# EAGLE design untitled (EAGLE 6.1)
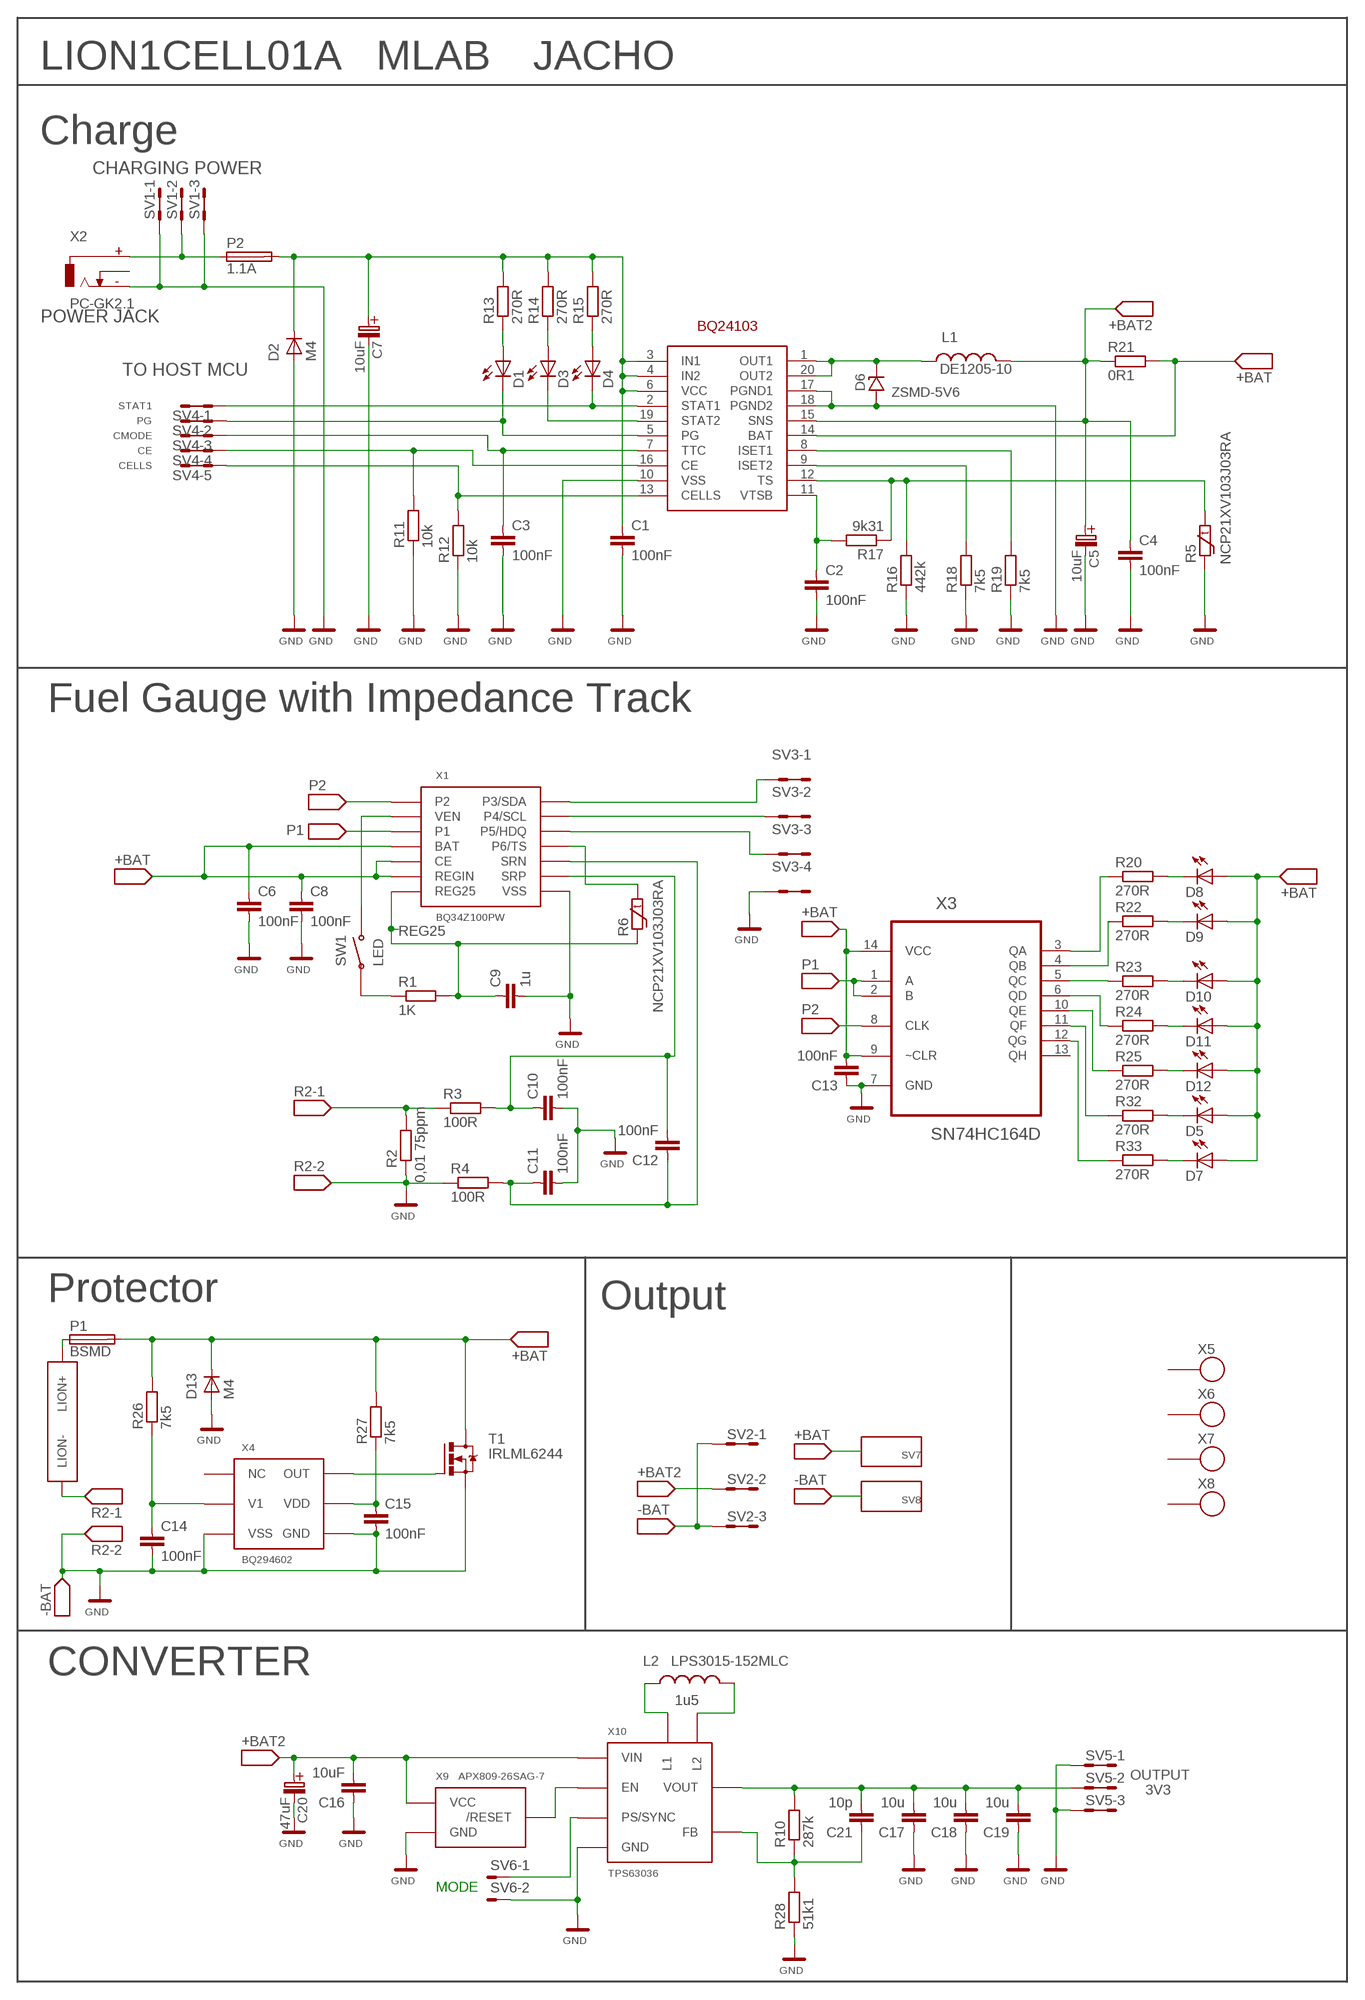
[diagram p0: schematic, sheet 1]

## Parts
C1  100nF  C0805  [C0805]
C2  100nF  C0805  [C0805]
C3  100nF  C0805  [C0805]
C4  100nF  C0805  [C0805]
C5  10uF  B  [B]
C6  100nF  C0805  [C0805]
C7  10uF  B  [B]
C8  100nF  C0805  [C0805]
C9  1u  C0805  [C0805]
C10  100nF  C0805  [C0805]
C11  100nF  C0805  [C0805]
C12  100nF  C0805  [C0805]
C13  100nF  C0805  [C0805]
C14  100nF  C0805  [C0805]
C15  100nF  C0805  [C0805]
C16  10uF  C0805  [C0805]
C17  10u  C0805  [C0805]
C18  10u  C0805  [C0805]
C19  10u  C0805  [C0805]
C20  47uF  B  [B]
C21  10p  C0603  [0603]
D1  LED1206_2  [1206_2]
D2  M4  D-OB.  [SMB]
D3  LED1206_2  [1206_2]
D4  LED1206_2  [1206_2]
D5  LED1206_2  [1206_2]
D6  ZSMD-5V6  D-ZENEROVA  [MINIMELF]
D7  LED1206_2  [1206_2]
D8  LED1206_2  [1206_2]
D9  LED1206_2  [1206_2]
D10  LED1206_2  [1206_2]
D11  LED1206_2  [1206_2]
D12  LED1206_2  [1206_2]
D13  M4  D-OB.SMA  [SMA]
L1  DE1205-10  [DE1205-10]
L2  LPS3015-152MLC  LPS3015  [LPS3015]
P1  BSMD  POJISTKA2410  [2410]
P2  1.1A  POJISTKA_1812  [1812]
R1  1K  R0805  [0805]
R2  0,01 75ppm  R0805  [0805]
R3  100R  R0805  [0805]
R4  100R  R0805  [0805]
R5  NCP21XV103J03RA  TERMISTOR0805  [0805]
R6  NCP21XV103J03RA  TERMISTOR0805  [0805]
R10  287k  R0603  [0603]
R11  10k  R0805  [0805]
R12  10k  R0805  [0805]
R13  270R  R0805  [0805]
R14  270R  R0805  [0805]
R15  270R  R0805  [0805]
R16  442k  R0805  [0805]
R17  9k31  R0805  [0805]
R18  7k5  R0805  [0805]
R19  7k5  R0805  [0805]
R20  270R  R0805  [0805]
R21  0R1  R-EU_R2512  [R2512]
R22  270R  R0805  [0805]
R23  270R  R0805  [0805]
R24  270R  R0805  [0805]
R25  270R  R0805  [0805]
R26  7k5  R0805  [0805]
R27  7k5  R0805  [0805]
R28  51k1  R0603  [0603]
R32  270R  R0805  [0805]
R33  270R  R0805  [0805]
SV1  MA03-2  [MA03-2]
SV2  MA03-2  [MA03-2]
SV3  MA04-2  [MA04-2]
SV4  MA05-2  [MA05-2]
SV5  MA03-2  [MA03-2]
SV6  MA02-1  [MA02-1]
SV7  WAGO256  [WAGO256]
SV8  WAGO256  [WAGO256]
SW1  TACT-64K  [TACT-64K]
T1  IRLML6244  IRLML6244TRPBF  [SOT23]
U1  BQ24103  [RHL_R-VQFN-N20]
U$2  LION1  [LION1]
X1  BQ34Z100PW  [TSSOP14]
X2  DC2.1MM  [DC2.1MM]
X3  SN74HC164D  [SOIC127P600X175-14N]
X4  BQ294602  [SON_N6]
X5  SROUB3M  [SROUB3M]
X6  SROUB3M  [SROUB3M]
X7  SROUB3M  [SROUB3M]
X8  SROUB3M  [SROUB3M]
X9  APX809-26SAG-7  APX809-26SA  [SOT23]
X10  TPS63036  [DSBGA8]

## Nets
+BAT: C6.1 C8.1 C13.2 D5.A D7.A D8.A D9.A D10.A D11.A D12.A D13.K(C) P1.2 R21.2 R26.2 R27.2 SV7.1 SV7.A1 T1.3(D) U1.14(BAT) X1.4(BAT) X1.5(CE) X1.6(REGIN) X3.9(~CLR) X3.14(VCC)
+BAT2: C4.1 C5.+(C_EL+) C16.2 C20.+(C_EL+) L1.P$2 R21.1 SV2.3 SV2.4 U1.15(SNS) X9.3(VCC) X10.A1(VIN)
EN: X9.2(/RESET) X10.A2(EN)
GND: C1.2 C2.2 C3.2 C4.2 C5.-(C_EL-) C6.2 C7.-(C_EL-) C8.2 C9.2 C10.2 C11.2 C13.1 C14.2 C15.2 C16.1 C17.1 C18.1 C19.1 C20.-(C_EL-) D2.A D6.A D13.A R2.1 R4.1 R5.1 R11.1 R12.1 R16.1 R18.1 R19.1 R28.1 SV1.1 SV1.2 SV1.5 SV1.6 SV2.1 SV2.2 SV2.5 SV2.6 SV3.7 SV3.8 SV5.1 SV5.2 SV5.5 SV5.6 SV6.2 SV8.1 SV8.A1 T1.2(S) U1.10(VSS) U1.17(PGND1) U1.18(PGND2) X1.8(VSS) X2.GND(-) X3.7(GND) X4.3(VSS) X4.4(VSS) X4.7(GND) X9.1(GND) X10.C2(GND)
N$1: C1.1 C7.+(C_EL+) D2.K(C) P2.2 R13.2 R14.2 R15.2 U1.3(IN1) U1.4(IN2) U1.6(VCC)
N$2: P1.1 U$2.+1(LION+) U$2.+(LION+)
N$3: D6.C(K) L1.P$1 U1.1(OUT1) U1.20(OUT2)
N$4: D4.K(C) SV4.1 SV4.2 U1.2(STAT1)
N$5: D3.K(C) U1.19(STAT2)
N$6: D1.K(C) SV4.3 SV4.4 U1.5(PG)
N$7: D1.A R13.1
N$8: D3.A R14.1
N$9: D4.A R15.1
N$10: R12.2 SV4.9 SV4.10 U1.13(CELLS)
N$11: R11.2 SV4.7 SV4.8 U1.16(CE)
N$12: C2.1 R17.2 U1.11(VTSB)
N$13: R18.2 U1.9(ISET2)
N$14: C3.1 SV4.5 SV4.6 U1.7(TTC)
N$15: R19.2 U1.8(ISET1)
N$16: SV3.3 SV3.4 X1.13(P4/SCL)
N$17: SW1.P$3 SW1.P$4 X1.2(VEN)
N$18: R5.2 R16.2 R17.1 U1.12(TS)
N$19: L2.1-1 L2.1-2 L2.1-3 X10.B1(L1)
N$20: R1.1 SW1.P$1 SW1.P$2
N$21: SV6.1 X10.B2(PS/SYNC)
N$22: R6.2 X1.11(P6/TS)
N$23: C10.1 C12.2 R3.2 X1.9(SRP)
N$24: SV3.5 SV3.6 X1.12(P5/HDQ)
N$25: SV3.1 SV3.2 X1.14(P3/SDA)
N$26: L2.2-1 L2.2-2 L2.2-3 X10.C1(L2)
N$27: C11.1 C12.1 R4.2 X1.10(SRN)
N$31: C17.2 C18.2 C19.2 C21.2 R10.2 SV5.3 SV5.4 X10.D1(VOUT)
N$32: C21.1 R10.1 R28.2 X10.D2(FB)
N$33: R20.1 X3.3(QA)
N$34: D8.K(C) R20.2
N$35: R22.1 X3.4(QB)
N$36: R23.1 X3.5(QC)
N$37: R24.1 X3.6(QD)
N$38: R25.1 X3.10(QE)
N$39: D9.K(C) R22.2
N$40: D11.K(C) R24.2
N$41: D12.K(C) R25.2
N$42: D10.K(C) R23.2
N$43: C14.1 R26.1 X4.2(V1)
N$44: C15.1 R27.1 X4.5(VDD)
N$45: T1.1(G) X4.6(OUT)
N$46: R32.1 X3.11(QF)
N$47: R33.1 X3.12(QG)
N$49: D5.K(C) R32.2
N$50: D7.K(C) R33.2
N$69: P2.1 SV1.3 SV1.4 X2.+
P1: X1.3(P1) X3.1(A) X3.2(B)
P2: X1.1(P2) X3.8(CLK)
R2: R2.2 R3.1 U$2.-1(LION-) U$2.-(LION-)
REG25: C9.1 R1.2 R6.1 X1.7(REG25)
Unconnected: X2.SW X3.13(QH) X4.1(NC) X5.P$1 X6.P$1 X7.P$1 X8.P$1

## Notes on the sheet
- LION1CELL01A | MLAB | JACHO
- Charge
- CHARGING POWER
- POWER JACK
- TO HOST MCU
- STAT1
- PG
- CMODE
- CE
- CELLS
- Fuel Gauge with Impedance Track
- REG25
- LED
- Protector | Output
- CONVERTER
- 1u5
- OUTPUT
- 3V3
- MODE

## Library data of the parts
C1-C4 C6 C8-C19 = moje_C:C0805
C5 C7 C20 = moje_C:B
C21 = moje_C:C0603
D1 D3-D5 D7-D12 = moje_diody:LED1206_2
D2 = moje:D-OB.: smb
D6 = moje_diody:D-ZENEROVA
D13 = moje:D-OB.SMA: SMA
L1 = moje_L:DE1205-10: tlumivka
L2 = moje_L:LPS3015
P1 = moje:POJISTKA2410: Pojistka BSMD (tme) v pouzdru 2410
P2 = moje:POJISTKA_1812: Pojistka s pouzdrem 1812
R1-R4 R11-R20 R22-R27 R32 R33 = moje_R:R0805
R5 R6 = moje_R:TERMISTOR0805
R10 R28 = moje_R:R0603
R21 = rcl:R-EU_: RESISTOR, European symbol
SV1 SV2 SV5 = moje_hrebinky:MA03-2: PIN HEADER; OC_FARNELL: unknown; OC_NEWARK: unknown
SV3 = moje_hrebinky:MA04-2: PIN HEADER; OC_FARNELL: unknown; OC_NEWARK: unknown
SV4 = moje_hrebinky:MA05-2: PIN HEADER; OC_FARNELL: unknown; OC_NEWARK: unknown
SV6 = moje_hrebinky:MA02-1
SV7 SV8 = moje_konektory:WAGO256: WAGO256
SW1 = moje_tlacitka:TACT-64K: Resetovací tlačítko TACT-64K
T1 = moje_T:IRLML6244TRPBF: HEXFET Power MOSFET
U1 = bq24103:BQ24103
U$2 = moje_baterky:LION1
X1 = moje_io:BQ34Z100PW
X2 = moje_konektory:DC2.1MM
X3 = moje_io:SN74HC164D: 8-BIT PARALLEL-OUT SERIAL SHIFT REGISTERS; MPN: SN74HC164D; OC_FARNELL: 9591184; OC_NEWARK: 36K3553; PACKAGE: SOIC-14; SUPPLIER: Texas Instruments
X4 = moje_io:BQ294602
X5-X8 = moje:SROUB3M
X9 = moje_io:APX809-26SA
X10 = moje_io:TPS63036

## Board
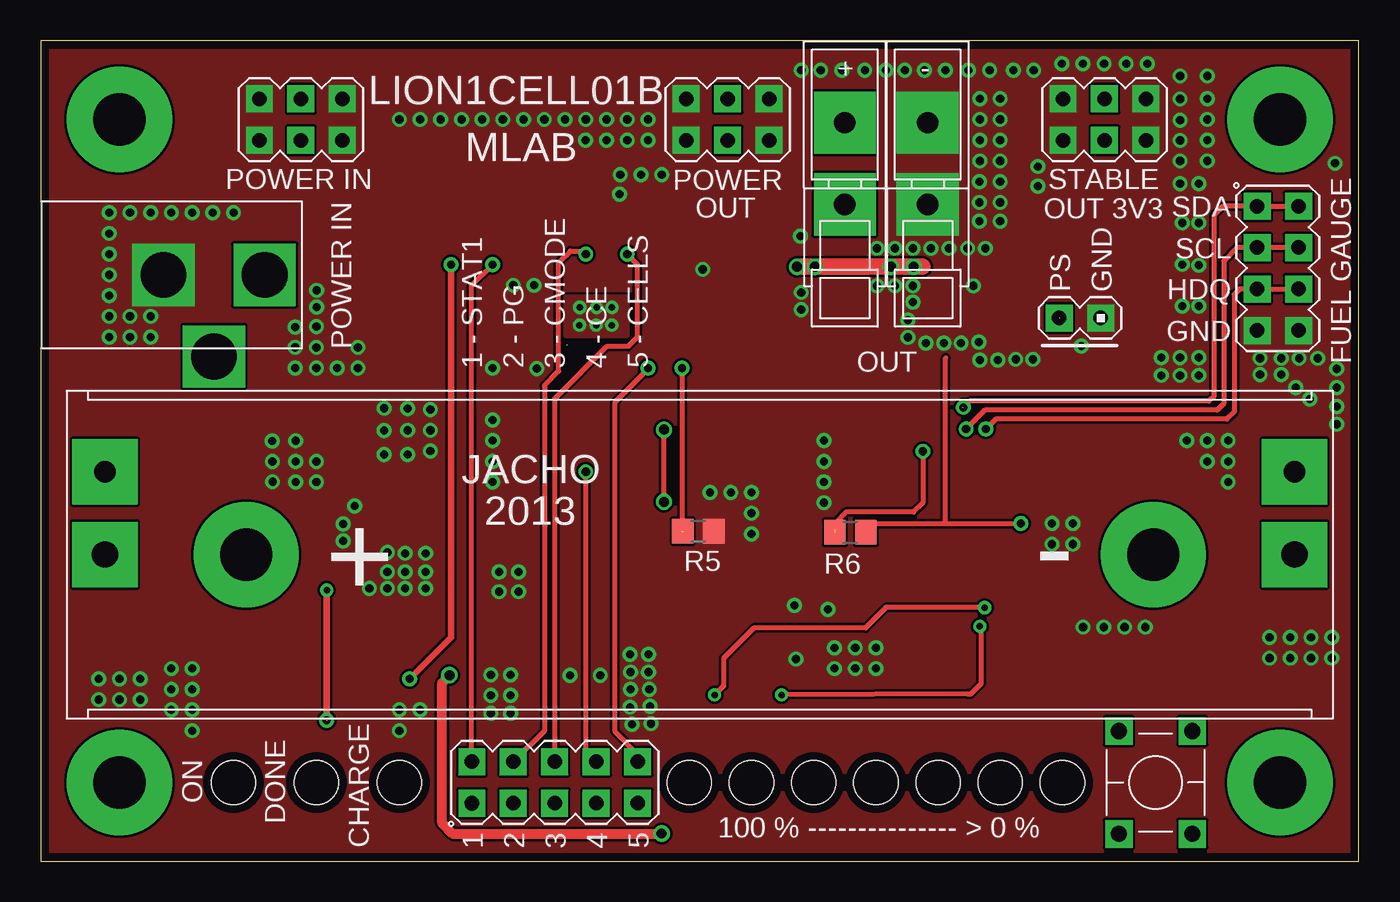
[diagram p1: board, top side]
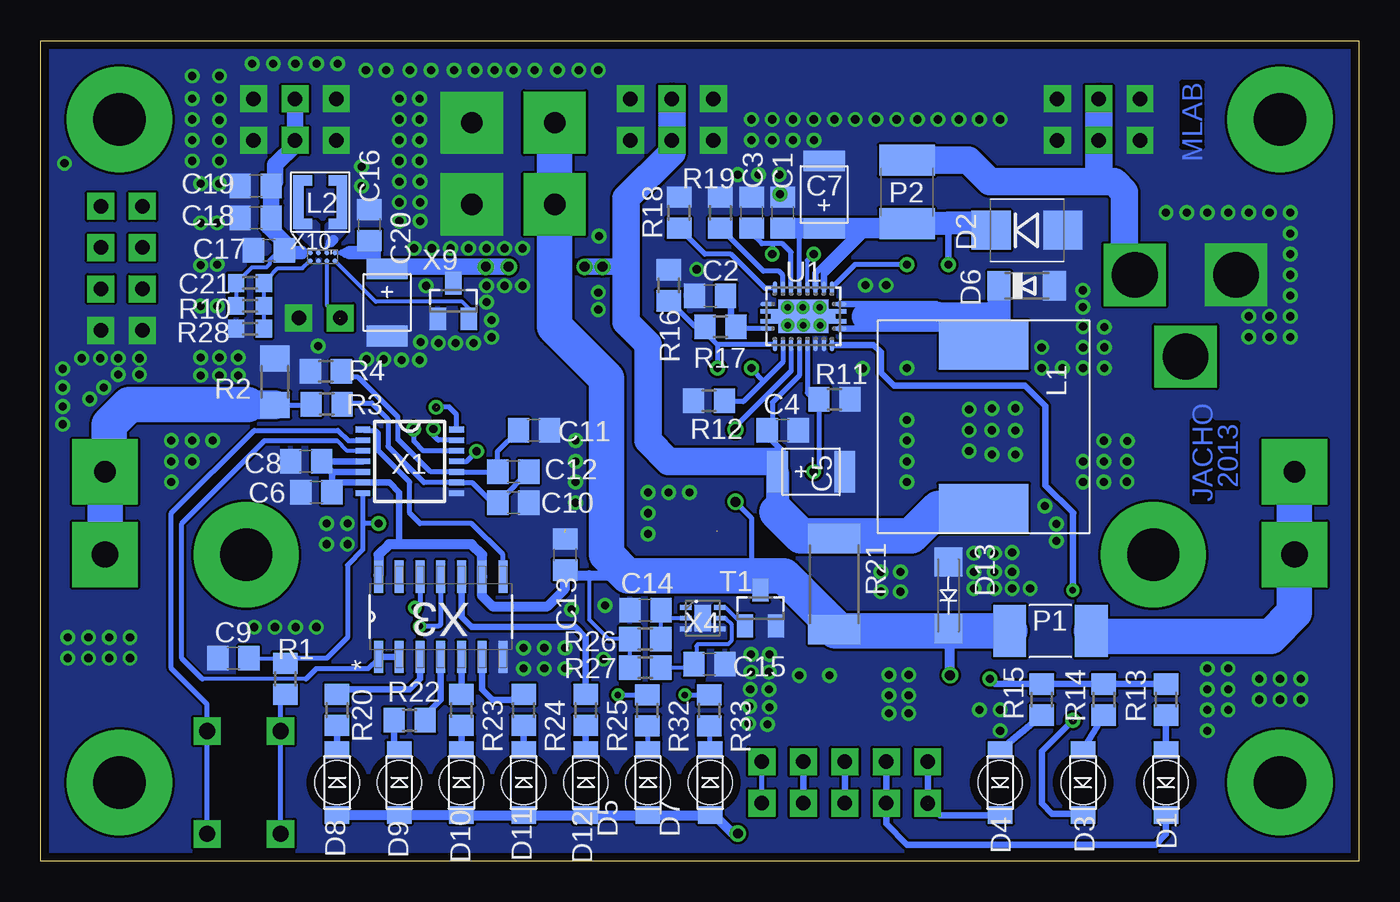
[diagram p2: board, bottom side, seen from below]

Size 80.77 x 50.29 mm. Coordinates in mm from the lower left corner, seen from the top.
Outline: 0,0 80.77,0 80.77,50.29 0,50.29 0,0
Copper layers (1*16): Top 0.035mm / dielectric 1.5mm / Bottom 0.035mm
Design rules: minimum track width 8mil, minimum drill 16mil, track to track 6mil, track to pad 6mil, pad to pad 6mil, via to via 6mil, smd to smd 6mil, copper to edge 20mil, drill to drill 8mil, minimum pad ring 10mil, minimum via ring 8mil, stop-mask expansion 4mil, vias tented up to drill 25mil, thermal gap 0mil

### Footprints (pad centres in the part's own frame; a part is rotated, then mirrored left to right if it is on the bottom)
C0805 = smd 1.3 x 1.5: 1 -0.95,0; 2 0.95,0
B = smd 1.27 x 2.54: + 2.223,0; - -1.905,0
0603 = smd 1 x 1.1: 1 -0.85,0; 2 0.85,0
1206_2 = smd 1.5 x 1.05: A 0,-2; K 0,2 | hole 2.7: 0,0
SMB = smd 2.4 x 2.4: A 2.2,0; K -2.2,0
MINIMELF = smd 1.4 x 1.8: A 1.7,0; C -1.7,0
SMA = smd 1.8 x 1.7: A -2.05,0; K 2.05,0
DE1205-10 = smd 3 x 5.5: P$1 -5,0; P$2 5,0
LPS3015 = smd 0.64 x 3.3: 1-1 -1.33,0; 2-1 1.33,0 | smd 0.51 x 0.64: 1-2 -0.765,1.33; 1-3 -0.765,-1.33; 2-2 0.765,-1.33; 2-3 0.765,1.33
2410 = smd 2 x 3.18: 1 -2.5,0; 2 2.5,0
1812 = smd 1.9 x 3.4: 1 -1.95,0; 2 1.95,0
0805 = smd 1.3 x 1.5: 1 -0.95,0; 2 0.95,0
1206 = smd 1.6 x 1.803: 1 -1.422,0; 2 1.422,0
R2512 = smd 1.8 x 3.2: 1 -2.8,0; 2 2.8,0
MA03-2 = drill 0.889 pad 1.651 square: 1 -2.54,-1.27; 2 -2.54,1.27; 3 0,-1.27; 4 0,1.27; 5 2.54,-1.27; 6 2.54,1.27
MA04-2 = drill 0.889 pad 1.651 square: 1 -3.81,-1.27; 2 -3.81,1.27; 3 -1.27,-1.27; 4 -1.27,1.27; 5 1.27,-1.27; 6 1.27,1.27; 7 3.81,-1.27; 8 3.81,1.27
MA05-2 = drill 0.914 pad 1.651 square: 1 -5.08,-1.27 | drill 0.889 pad 1.651 square: 2 -5.08,1.27; 3 -2.54,-1.27; 4 -2.54,1.27; 5 0,-1.27; 6 0,1.27; 7 2.54,-1.27; 8 2.54,1.27; 9 5.08,-1.27; 10 5.08,1.27
MA02-1 = drill 0.889 pad 1.651 square: 1 -1.27,0; 2 1.27,0
WAGO256 = drill 1.3 pad 3.81 square: 1 2.54,0; A1 -2.46,0
TACT-64K = drill 1 pad 1.676 square: P$1 -3.15,2.25; P$2 3.15,2.25; P$3 -3.15,-2.25; P$4 3.15,-2.25
SOT23 = smd 1 x 1.4: 1 -0.95,-1.1; 2 0.95,-1.1; 3 0,1.1
RHL_R-VQFN-N20 = smd 0.85 x 0.28: 1 -2.225,-0.75; 10 2.225,-0.75; 11 2.225,0.75; 20 -2.225,0.75 | smd 0.28 x 0.85: 2 -1.75,-1.725; 3 -1.25,-1.725; 4 -0.75,-1.725; 5 -0.25,-1.725; 6 0.25,-1.725; 7 0.75,-1.725; 8 1.25,-1.725; 9 1.75,-1.725; 12 1.75,1.725; 13 1.25,1.725; 14 0.75,1.725; 15 0.25,1.725; 16 -0.25,1.725; 17 -0.75,1.725; 18 -1.25,1.725; 19 -1.75,1.725 | smd 3.05 x 2.05: EXP@1 0,0 | smd 1.125 x 0.28: EXP@2 2.075,-0.3; EXP@4 2.075,0.3; EXP@5 -2.075,0.3; EXP@7 -2.075,-0.3 | smd 0.45 x 0.4: EXP@3 1.75,0; EXP@6 -1.75,0
LION1 = drill 1.6 pad 4 square: + -36.45,0; - 36.45,0 | drill 1.3 pad 4 square: +1 -36.45,5.08; -1 36.45,5.08 | drill 3.2 pad 6.452: SROUB3 -27.805,0; SROUB4 27.805,0
TSSOP14 = smd 0.9 x 0.35: 1 -2.875,1.95; 2 -2.875,1.3; 3 -2.875,0.65; 4 -2.875,0; 5 -2.875,-0.65; 6 -2.875,-1.3; 7 -2.875,-1.95; 8 2.875,-1.95; 9 2.875,-1.3; 10 2.875,-0.65; 11 2.875,0; 12 2.875,0.65; 13 2.875,1.3; 14 2.875,1.95
DC2.1MM = drill 2.8 square: + -3.81,0; GND 2.39,0; SW -0.71,5
SOIC127P600X175-14N = smd 1.981 x 0.559: 1 -2.464,3.81; 2 -2.464,2.54; 3 -2.464,1.27; 4 -2.464,0; 5 -2.464,-1.27; 6 -2.464,-2.54; 7 -2.464,-3.81; 8 2.464,-3.81; 9 2.464,-2.54; 10 2.464,-1.27; 11 2.464,0; 12 2.464,1.27; 13 2.464,2.54; 14 2.464,3.81
SON_N6 = smd 0.3 x 0.7: 1 -0.65,-1.05; 2 0,-1.05; 3 0.65,-1.05; 4 0.65,1.05; 5 0,1.05; 6 -0.65,1.05 | smd 1.6 x 1: 7 0,0
SROUB3M = drill 3.2 pad 6.452: P$1 0,0
DSBGA8 = smd 0.3 x 0.3: A1 -0.75,-0.25; A2 -0.75,0.25; B1 -0.25,-0.25; B2 -0.25,0.25; C1 0.25,-0.25; C2 0.25,0.25; D1 0.75,-0.25; D2 0.75,0.25

### Placement (x,y rotation side)
C1  35.31,39.75 90 bottom
C2  39.75,34.67 180 bottom
C3  37.21,39.75 90 bottom
C4  35.31,26.42 0 bottom
C5  33.4,23.88 180 bottom
C6  63.88,22.61 180 bottom
C7  32.77,41.02 270 bottom
C8  64.52,24.51 180 bottom
C9  68.96,12.45 180 bottom
C10  51.82,21.97 0 bottom
C11  50.55,26.42 0 bottom
C12  51.82,23.88 0 bottom
C13  48.64,18.8 270 bottom
C14  43.72,15.4 180 bottom
C15  39.8,12.08 0 bottom
C16  60.65,39 270 bottom
C17  66.8,37.45 0 bottom
C18  67.6,39.45 0 bottom
C19  67.6,41.4 0 bottom
C20  59.55,34.1 90 bottom
C21  67.95,35.45 180 bottom
D1  11.81,4.83 180 bottom
D2  20.33,38.68 0 bottom
D3  16.89,4.83 180 bottom
D4  21.97,4.83 180 bottom
D5  43.56,4.83 0 bottom
D6  20.35,35.27 0 bottom
D7  39.75,4.83 0 bottom
D8  62.61,4.83 0 bottom
D9  58.8,4.83 0 bottom
D10  54.99,4.83 0 bottom
D11  51.18,4.83 0 bottom
D12  47.37,4.83 0 bottom
D13  25.15,16.3 270 bottom
L1  22.98,26.63 270 bottom
L2  63.65,40.4 180 bottom
P1  18.89,14.11 180 bottom
P2  27.69,41.02 270 bottom
R1  65.79,11.18 90 bottom
R2  0,01 75ppm  [1206]  66.42,29.39 270 bottom
R3  63.25,28.02 0 bottom
R4  63.3,30.03 0 bottom
R5  40.3,20.23 180 top
R6  49.62,20.16 180 top
R10  67.95,34.05 180 bottom
R11  32.13,28.32 180 bottom
R12  39.82,28.23 0 bottom
R13  11.81,9.91 90 bottom
R14  15.62,9.91 90 bottom
R15  19.43,9.91 90 bottom
R16  42.29,35.31 270 bottom
R17  39.12,32.77 0 bottom
R18  41.66,39.75 270 bottom
R19  39.12,39.75 270 bottom
R20  62.61,9.27 270 bottom
R21  32.15,17 270 bottom
R22  58.17,8.64 180 bottom
R23  54.99,9.27 270 bottom
R24  51.18,9.27 270 bottom
R25  47.37,9.27 270 bottom
R26  43.72,13.63 180 bottom
R27  43.72,11.87 180 bottom
R28  67.95,32.65 0 bottom
R32  43.6,9.25 270 bottom
R33  39.8,9.25 270 bottom
SV1  15.94,45.47 0 top
SV2  42.1,45.47 0 top
SV3  75.82,36.34 270 top
SV4  31.5,4.83 0 top
SV5  65.2,45.47 180 top
SV6  63.7,33.3 0 top
SV7  49.28,42.81 270 top
SV8  54.36,42.81 270 top
SW1  68.33,4.83 90 top
T1  36.67,15.52 0 bottom
U1  34.04,33.4 180 bottom
U$2  40.39,18.8 0 top
X1  58.17,24.51 0 bottom
X2  9.91,35.94 180 top
X3  56.26,14.99 90 bottom
X4  40.21,14.9 270 bottom
X5  4.83,4.83 0 top
X6  4.83,45.47 180 top
X7  75.95,45.47 90 top
X8  75.95,4.83 0 top
X9  55.5,34.35 0 bottom
X10  63.5,37.05 180 bottom

### Tracks (layer width: path | path; a pad name or v marks a point on that pad's centre or on a via)
+BAT  (via drill 0.6)
  Top 0.305: v38.2,22.03 v38.2,26.46
  Top 0.61: v25.05,11.4 24.6,10.95 24.6,2.35 25.25,1.7 v38.05,1.7
  Bottom 0.254: U1.14 34.79,31.38 | R27.2 R26.2 45.98,13.63 47.15,14.8 47.15,17.53 | D13.K 24.5,14.3 24.75,14.05 24.8,14.05 25.05,13.8 25.15,13.8
  Bottom 0.305: 34.79,31.38 34.79,30.06 38.15,26.7 38.2,26.7 v38.2,26.46 | v38.2,22.03 37.21,21.04 37.21,17.38 | 37.21,17.38 37.25,17.35 | 37.21,17.38 37.29,17.38 37.4,17.49
  Bottom 0.406: 62.93,23.88 C8.1 X1.4 | 62.93,23.88 C6.1 62.9,23.21 X1.6 59.41,23.21 58.8,22.61 58.8,19.43 | X1.5 62.92,23.86 62.93,23.88 | 60.07,17.53 X3.14 | 48.2,31.8 48.31,31.8 49.03,32.52
  Bottom 0.61: 60.07,17.53 60.07,18.8 59.44,19.43 58.8,19.43 54.36,19.43 53.72,18.8 X3.9 53.72,16.26 53.09,15.62 49.72,15.62 48.65,16.7 48.65,17.7 48.7,17.75 48.7,17.79 C13.2 48.64,17.53 47.15,17.53 45.47,17.53 | 39.8,2.92 39.8,2.8 40.25,2.8 40.25,2.83 | D5.A D12.A D11.A D10.A D9.A | D5.A 43.5,2.83 43.5,2.8 43.56,2.8 D5.A | D5.A 40.25,2.83 | 40.25,2.83 D7.A | D9.A 58.85,2.83 58.85,2.8 | D9.A D8.A | D5.A 39.48,2.83 38.35,1.7 v38.05,1.7 | v25.05,11.4 25.05,13.8 25.05,13.86 25.3,14.11
  Bottom 0.813: 44.2,17.53 44.83,17.53 45.47,17.53 | T1.3 39.12,17.49
  Bottom 1.016: 49.28,33.25 49.28,36.22 48.95,36.55
  Bottom 1.422: 36.89,17.8 36.58,17.49
  Bottom 2.184: SV7.A1 SV7.1 49.28,33.25 49.28,32.77 49.03,32.52 46.1,29.59 46.1,18.8 44.83,17.53 44.79,17.49 39.12,17.49 37.4,17.49 36.58,17.49 35.24,17.49 32.05,14.3 R21.2 32.06,14.11 25.3,14.11 P1.2
+BAT2  (via drill 0.6)
  Top 1.016: 46.4,36.45 v47.45,36.45 51.9,36.45 v52.1,36.45 54.05,36.45
  Bottom 0.254: C5.+ 35.31,23.88 | X10.A1 62.35,37.3 | 61.8,37.1 62,37.3
  Bottom 0.305: U1.15 34.29,29.78 35.94,28.12 35.94,26.42 C4.1 | 34.2,19.95 32.4,19.95 32.3,19.85 32.3,19.8 32.2,19.7 | 32.2,19.7 32.2,19.8 32.15,19.85 | R21.1 32.15,19.75 32.2,19.7
  Bottom 0.406: 35.31,23.88 35.31,25.15 36.26,26.1 | 36.26,26.1 36.58,26.42 | C4.1 36.26,26.1 | C5.+ 35.62,24.19 35.94,24.51 | 62.35,37.3 62.1,37.3
  Bottom 0.61: 62.1,37.3 62,37.3 61.85,37.3
  Bottom 0.813: 61.85,37.3 60.4,37.3 60.35,37.25 | 60.35,37.25 60.35,37.75 C16.2 | 60.35,37.25 60.35,36.55 60.3,36.5 59.72,36.5 C20.+ | X9.3 55.5,36.45
  Bottom 1.016: C20.+ 59.05,36.32 59.05,36.45 55.5,36.45 v53.5,36.45 v52.1,36.45 54.45,36.45 | 44.9,36.45 v46.35,36.45 v47.45,36.45 | 44.85,36.55 44.85,36.45 44.9,36.45 | 44.9,36.45 44.9,36.25
  Bottom 1.422: C5.+ 35.62,21.37 | 35.25,20.9 35.62,21.27 35.62,21.37 | 35.62,21.37 35.65,21.4 | 27.47,19.57 27.85,19.95
  Bottom 1.676: 35.94,24.51 42.29,24.51 43.56,25.78 43.56,31.71 44.9,33.05 44.9,36.25 44.9,40.65 42.1,43.45 SV2.3 SV2.4
  Bottom 2.184: L1.P$2 25.76,21.63 27.45,19.95 27.85,19.95 34.2,19.95 35.65,21.4
EN
  Bottom 0.254: X9.2 54.55,33.9 54.95,34.3 60.25,34.3 X10.A2
GND  (via drill 0.5)
  other vias: 48.64,13.08 49.91,13.08 51.18,13.08 51.18,11.81 49.91,11.81 48.64,11.81 61.98,20.7 63.25,20.7 61.98,19.43 63.25,19.43 35.52,42.09 36.79,42.09 38.06,42.09 35.48,40.89 40.57,36.28 16.89,23.24 16.89,24.51 15.62,23.24 15.62,24.51 14.19,24.51 14.2,23.26 16.89,32.77 16.91,33.97 19.43,31.5 16.89,31.5 16.91,35 16.89,30.23 18.16,30.23 19.43,30.23 23.24,45.47 24.51,45.47 25.78,45.47 27.05,45.47 28.32,45.47 29.59,45.47 30.86,45.47 32.13,45.47 33.4,45.47 34.67,45.47 34.67,44.2 35.94,44.2 37.21,44.2 33.38,44.2 4.19,39.75 5.46,39.75 6.73,39.75 8,39.75 9.27,39.75 10.54,39.75 11.81,39.75 75.31,13.72 76.58,13.72 77.85,13.72 79.12,13.72 75.31,12.45 76.58,12.45 77.85,12.45 79.12,12.45 63.88,14.35 65.15,14.35 66.42,14.35 67.69,14.35 3.56,11.18 4.83,11.18 6.1,11.18 3.56,9.91 4.83,9.91 6.1,9.91 28.79,11.42 15.63,25.78 22.48,24.94 14.18,25.76 21.04,27.77 21.04,26.4 21.04,24.93 23.88,26.42 23.88,27.69 27.69,30.23 30.4,30.21 21.97,45.47 36.11,9.44 37.24,11.59 36.12,12.69 30.23,35.31 28.96,35.31 15.59,30.23 15.59,31.51 15.59,32.74 4.19,38.48 4.19,37.21 4.19,35.94 4.19,34.67 4.19,33.4 4.19,32.13 5.46,32.13 6.73,32.13 6.73,33.4 5.46,33.4 48.01,21.97 48.01,23.24 48.01,24.51 48.01,25.78 72.77,23.25 70.23,25.78 71.5,25.78 72.77,25.78 71.5,24.51 72.77,24.51 41.02,22.61 42.29,22.61 43.56,22.61 43.56,21.34 43.56,20.07 23.88,25.15 27.69,27.05 27.69,25.78 27.69,24.51 27.69,23.24 22.48,26.42 22.48,27.75 21.97,9.27 21.97,8 23.24,9.27 9.27,8 9.27,9.27 9.27,10.54 9.27,11.81 8,11.81 8,10.54 8,9.27 71.5,46.74 35.94,45.47 71.5,45.47 37.21,45.47 71.5,42.93 71.5,44.2 58.8,46.74 58.8,45.47 58.8,44.2 58.8,42.93 58.8,41.66 57.53,41.66 57.53,40.39 58.8,40.39 57.55,46.74 57.55,45.47 57.55,44.2 57.55,42.93 52.95,48.49 54.15,48.49 55.45,48.49 56.85,48.49 58.15,48.49 28.79,10.17 51.25,37.57 52.35,37.57 53.45,37.57 54.55,37.57 55.65,37.57 56.8,37.57 57.9,37.57 51.25,35.27 52.35,35.27 53.45,35.27 53.45,34.27 53.15,32.12 53.15,33.17 79.42,26.78 79.42,27.88 79.42,29.03 79.42,30.18 78.27,30.83 79.32,42.78 77.77,28.33 76.92,29.03 76.02,29.83 74.72,29.83 70.97,29.78 69.82,29.78 68.67,29.78 68.67,30.88 69.82,30.88 70.97,30.88 70.97,34.03 70.97,36.53 70.97,39.13 70.97,41.53 69.82,41.53 69.82,42.93 69.82,44.18 69.82,45.43 69.82,46.73 69.82,48.13 67.82,48.88 66.52,48.88 65.17,48.88 63.87,48.88 62.57,48.88 71.5,48.14 59.6,48.49 60.85,48.49 61.1,41.39 61.1,42.59 63.77,31.58 36.14,11.59 36.14,10.54 22.34,18.88 21.24,18.93 22.34,17.73 21.24,17.73 28.09,17.73 29.29,17.73 29.29,16.53 28.09,16.53 57.53,39.24 58.8,39.24 46.6,48.49 47.8,48.49 49.1,48.49 50.5,48.49 51.8,48.49 37.29,10.54 37.24,12.69 27.59,11.42 27.59,10.17 46.19,15.69 48.24,15.44 46.29,12.39 36.24,8.39 37.34,9.49 34.29,11.39 37.39,8.44 27.59,9.07 28.79,9.07 32.44,11.39 57.15,35.27 54.25,31.77 55.35,31.77 56.4,31.77 57.5,31.82 57.55,30.72 58.65,30.72 59.75,30.77 60.8,30.77 74.72,30.83 76.02,30.83 77.12,30.83 69.97,34.03 69.97,36.58 69.97,39.13 46.55,38.32 46.6,33.82 46.6,34.87 21.24,16.73 22.34,16.73 20.14,16.73 19.24,21.78 18.54,20.68 18.54,19.63 23.59,18.88 23.59,17.73 23.59,16.73
  pour Bottom (rank 2): -0.25,-0.25 81.03,-0.25 81.03,50.55 -0.25,50.55
  pour Top (rank 2): -0.25,-0.89 80.39,-0.89 81.03,-0.25 81.03,55.63 76.58,54.36 4.19,53.09 -0.25,53.72
N$1  (via drill 0.5)
  Top 0.406: v22.61,11.18 25.15,13.72 v25.15,36.58
  Bottom 0.254: U1.6 34.29,38.23
  Bottom 0.305: U1.6 34.29,38.55 | 34.29,38.23 33.4,39.12 | 30.86,38.48 31.5,38.48 | 27.96,38.8 28.49,38.8 28.68,38.99 28.55,38.99 28.4,39.13 | 28.4,39.13 28.3,39.24 28.34,39.28 28.34,39.24 28.38,39.2 28.38,39.15 28.3,39.07 28.34,39.07 | 28.32,39.12 28.39,39.12 28.4,39.13
  Bottom 0.406: 34.29,38.55 34.04,38.8 | 32.77,38.48 C7.+ | 31.5,38.48 31.5,38.8 | U1.4 33.29,36.06 30.86,38.48 | 30.23,38.48 32.79,35.92 U1.3 32.79,36.18 30.16,38.8 | R13.2 R14.2 R15.2 22.29,10.86 v22.61,11.18 | v25.15,36.58 25.15,39.12
  Bottom 1.27: C1.1 34.04,38.8 C7.+ | C7.+ | C7.+ 31.5,38.8 30.16,38.8 27.96,38.8 P2.2
  Bottom 1.422: 28.32,39.12 25.15,39.12 22.67,39.12 22.4,38.85 22.4,38.45 22.53,38.58 D2.K
N$2
  Bottom 2.184: U$2.+1 U$2.+ 3.94,15.26 5.4,13.8 16.08,13.8 P1.1
N$3
  Bottom 0.254: 25.67,32.65 25.67,32.73 25.1,33.3
  Bottom 0.406: U1.1 25.9,34.15 25.78,34.04 25.78,33.4 25.78,32.77 | U1.20 25.67,32.65
  Bottom 1.422: D6.C 22.05,33.15 | L1.P$1 22.77,31.85 21.8,31.85 22.05,32.1 22.05,33.15 | 22.05,33.15 22.25,33.35 | 25.78,33.4 25.2,33.4 25.1,33.3
  Bottom 1.676: 25.78,33.4 30.23,33.4
  Bottom 1.778: 25.78,33.4 22.3,33.4 22.25,33.35
N$4  (via drill 0.5)  (1 unrouted)
  Top 0.305: SV4.2 26.42,35.31 v27.69,36.58
  Bottom 0.305: v27.69,36.58 30.86,36.58 32.29,35.15 U1.2
  Bottom 0.406: SV4.1 SV4.2 | D4.K 25.68,2.83 26.4,3.55
N$5  (via drill 0.4, 0.5)  (2 unrouted)
  Top 0.406: v17.53,16.62 17.53,8.62 17.55,8.6
  Bottom 0.406: U1.19 32.29,31.65 | 17.05,3.08 D3.K 16.89,2.92 18.8,2.92 19.43,3.56 19.43,6.73 v17.53,8.64 | 17.5,21.35 17.53,21.38 | 17.53,21.38 19.2,23.05 19.2,27.9 20.45,29.15 28.5,29.15 29.3,29.95 29.3,31.2 29.75,31.65 32.25,31.65 | v17.53,16.62 17.53,21.38
N$6  (via drill 0.5)
  Top 0.305: SV4.4 30.86,8 30.86,29.15 31.75,30.04 31.75,36.7 32.46,37.41 33.21,37.41 v33.4,37.21
  Bottom 0.254: U1.5 33.79,36.83
  Bottom 0.305: 33.79,36.83 v33.4,37.21
  Bottom 0.406: D1.K 11.81,1.65 12.45,1.02 27.69,1.02 28.96,2.29 SV4.3 SV4.4
N$7
  Bottom 0.406: D1.A R13.1
N$8
  Bottom 0.406: D3.A R14.1
N$9
  Bottom 0.406: D4.A R15.1
N$10  (via drill 0.5)
  Top 0.305: SV4.10 36.58,6.57 35.2,7.95 35.2,28.15 37.25,30.2 37.24,30.2 v37.21,30.23
  Bottom 0.305: U1.13 35.29,30.6 36.47,29.42 | SV4.9 SV4.10 | 36.47,29.42 37.71,28.18 38.82,28.18 R12.2 | v37.21,30.23 37.21,30.16 36.47,29.42
N$11  (via drill 0.5)
  Top 0.305: v33.4,23.88 33.4,6.73 SV4.8
  Bottom 0.305: U1.16 33.79,28.71 33.4,28.32 | R11.2 33.08,24.2 v33.4,23.88
  Bottom 0.406: SV4.7 SV4.8 | R11.2 33.4,28.32
N$12
  Bottom 0.305: U1.11 38.05,32.65 R17.2
  Bottom 0.406: R17.2 38.48,32.77 38.48,34.67 C2.1 39.12,34.67
N$13
  Bottom 0.305: U1.9 36.4,35.13 38.48,37.21 40.07,37.21 R18.2
N$14  (via drill 0.5)  (1 unrouted)
  Top 0.305: SV4.6 31.5,28.35 34.72,31.57 36.01,31.57 36.57,32.13 36.57,36.58 v35.94,37.21
  Bottom 0.305: C3.1 37.21,38.48 36.58,37.85 35.94,37.85 | U1.7 34.79,37.33 35.31,37.85 35.94,37.85 | 35.94,37.85 v35.94,37.21
  Bottom 0.406: SV4.5 SV4.6
N$15
  Bottom 0.305: U1.8 35.29,35.93 35.53,36.17 36.48,36.17 R19.2
N$16  (via drill 0.5)
  Top 0.305: SV3.4 SV3.3 73.31,37.61 72.5,36.8 72.5,28.05 72.1,27.65 57.87,27.65 v56.71,26.49
  Bottom 0.305: X1.13 56.41,25.81 56.7,26.1 56.7,26.48 v56.71,26.49
N$17
  Bottom 0.305: X1.2 61.07,25.78 61.92,25.78 62.55,26.42 67.69,26.42 72.77,21.34 72.77,11.81 70.58,9.62 SW1.P$4 SW1.P$3
N$18  (via drill 0.5)  (1 unrouted)
  Top 0.305: v39.3,30.23 39.3,20.21 39.28,20.19
  Bottom 0.305: U1.12 39.3,31.68 | 39.3,31.68 40.39,32.77 | 42.29,34.67 R16.2 42.28,34.37 42.28,34.69 42.36,34.61 42.36,34.45 40.68,32.77 40.39,32.77 | R17.1 40.39,32.77 | 39.3,31.68 v39.3,30.23
N$19
  Bottom 0.254: X10.B1 63.25,37.7 63.15,37.8 | L2.1-1 62.32,41.47 62.55,41.7 62.85,41.7 L2.1-3
  Bottom 0.406: 63.15,37.8 63,37.95
  Bottom 0.61: 63,37.95 62.85,38.1
  pour Bottom: 62.1,38.95 62.1,38.65 62.9,37.8 63.25,37.8 63.25,39 63,39.25 63,38.8 62.8,39 62.15,39
N$20
  Bottom 0.305: SW1.P$1 SW1.P$2 66.08,9.94 R1.1
N$21  (1 unrouted)
  Bottom 0.254: X10.B2 63.25,34.1 62.45,33.3
N$22  (via drill 0.5)  (1 unrouted)
  Top 0.305: 48.66,20.35 48.77,20.46 48.77,20.81 49.36,21.4 53.5,21.4 54.06,21.96 v54.06,25.13
  Bottom 0.305: X1.11 54.67,24.51 v54.06,25.13
N$23
  Bottom 0.305: C12.2 52.45,22.29 52.45,21.97 C10.1 53.09,21.97 54.33,23.21 X1.9 57.28,23.21 59.5,25.43 59.5,27.1 60.5,28.1 62.3,28.1 | 61.86,28.31 61.84,28.33 62.27,28.33 | 62.27,28.33 62.29,28.35 | 62.27,28.33 62.29,28.33 R3.2 62.3,28.1 | 62.3,28.1 62.35,28.1
  Bottom 0.406: 62.61,28.32 R3.2
N$24  (via drill 0.5)
  Top 0.305: 74.57,35.1 SV3.5 | SV3.5 SV3.6 | SV3.5 73.47,35.07 73.15,34.75 73.15,27.55 72.7,27.1 58.52,27.1 v57.92,26.49
  Bottom 0.305: X1.12 57.31,25.16 57.9,25.75 57.9,26.47 v57.92,26.49
N$25  (via drill 0.5)  (1 unrouted)
  Top 0.305: 77.05,40.15 SV3.2 SV3.1 72.45,40.15 71.9,39.6 71.9,28.5 71.6,28.2 56.92,28.2 v56.54,27.82
  Bottom 0.305: X1.14 55.29,27.39 55.75,27.85 56.5,27.85
N$26
  Bottom 0.254: L2.2-2 64.82,41.73 65,41.55 65,40.42 L2.2-1
  pour Bottom: 63.75,37.3 63.75,39 63.95,39.2 65.15,39.2 65.15,38.7
N$27
  Bottom 0.305: C11.1 52.77,25.15 C12.1 52.78,23.86 X1.10 56.88,23.86 58.9,25.88 58.9,27.25 61.33,29.68 62.28,29.68 62.45,29.85 62.45,29.95 62.35,30.05 R4.2
N$28  (via drill 0.4)
  other vias: 33.02,32.86 34.04,32.86 35,32.86 33.04,33.96 34.07,33.95 35.01,33.96
  pour Top: 32.2,34.55 35.9,34.55 35.9,32.25 32.2,32.25
N$31
  Bottom 0.254: X10.D1 64.55,37.3 | R10.2 C21.2 67.85,36.4 66.95,36.4 66.75,36.6 66.75,36.85 66.15,37.45 C17.2 65.65,37.3
  Bottom 0.406: 64.55,37.3 64.8,37.3
  Bottom 0.813: 64.8,37.3 65.65,37.3 65.7,37.35 | C17.2 65.65,37.75 | 66.8,38.9 66.8,39.3 C18.2 | 66.4,41.65 C19.2
  Bottom 1.016: 65.65,37.75 66.8,38.9 | C18.2 C19.2 | 66.4,41.65 66.4,42.7 65.2,43.9 SV5.4 SV5.3
N$32
  Bottom 0.254: 67.15,34.2 R10.1 | R28.2 R10.1 | R10.1 67.1,34.1 | 67.1,34.1 67.1,34.15 | R10.1 C21.1 67.15,35.75 66.85,35.75 66.25,36.35 64.75,36.35 64.3,36.8 X10.D2 | 67.1,34.1 67.2,34.2
N$33
  Bottom 0.406: X3.3 57.53,11.18 58.17,10.54 61.98,10.54 62.61,9.91 R20.1
N$34
  Bottom 0.406: D8.K R20.2
N$35
  Bottom 0.406: X3.4 56.26,9.91 57.53,8.64 R22.1
N$36
  Bottom 0.406: R23.1 X3.5
N$37
  Bottom 0.406: X3.6 53.72,10.54 53.09,9.91 51.18,9.91 R24.1 51.18,10.54
N$38
  Bottom 0.406: R25.1 47.37,13.72 48.01,14.35 54.36,14.35 54.99,14.99 X3.10
N$39
  Bottom 0.406: R22.2 59.12,6.82 59.1,6.8 58.83,6.8 D9.K
N$40
  Bottom 0.406: D11.K R24.2
N$41
  Bottom 0.406: D12.K R25.2
N$42
  Bottom 0.406: D10.K R23.2
N$43
  Bottom 0.254: R26.1 42.77,15.32 42.72,15.37 | 42.72,15.37 42.7,15.4 | X4.2 42.27,14.9 C14.1 42.75,15.4 42.72,15.37
N$44
  Bottom 0.254: X4.5 38.8,14.9 38.45,14.55 38.45,13.5 38.65,13.3 40.5,13.3 40.6,13.2 40.6,12.25 40.75,12.1 C15.1 40.95,11.87 R27.1
N$45
  Bottom 0.254: X4.6 38.8,15.55 37.95,14.7 37.9,14.7 37.65,14.45 37.64,14.45 T1.1 37.65,14.4
N$46  (via drill 0.4)
  Top 0.305: v45.4,10.2 56.8,10.25 57,10.25 57.65,10.9 57.65,14.25 57.5,14.4 v57.55,14.4
  Bottom 0.305: X3.11 56.26,14.53 56.4,14.4 v57.55,14.4 | v45.4,10.2 43.7,10.2 43.65,10.25 R32.1
N$47  (via drill 0.4)
  Top 0.305: v57.85,15.55 51.8,15.55 50.55,14.3 43.7,14.3 41.85,12.45 41.85,10.75 v41.3,10.2
  Bottom 0.305: X3.12 57.53,15.86 v57.85,15.55 | v41.3,10.2 R33.1
N$49
  Bottom 0.305: D5.K 43.56,8.05 | 43.56,8.05 43.56,8.13 43.55,8.15 | R32.2 43.56,8.05
N$50
  Bottom 0.305: D7.K 39.75,8.04 R33.2
N$69
  Bottom 1.676: P2.1 23.92,42.97 22.61,41.66 15.62,41.66 | 15.62,41.66 14.99,41.66 14.35,41.02 14.35,36.58 X2.+ | SV1.4 SV1.3 15.94,42.29 15.94,41.97 15.62,41.66
P1
  Bottom 0.254: X1.3 61.99,25.16 62.61,25.78 | 64.52,11.18 70.87,11.18
  Bottom 0.305: X3.1 60.07,12.45 60.71,11.81 63.88,11.81 64.52,11.18 | 70.87,11.18 72.14,12.45 72.14,20.7 67.06,25.78 62.61,25.78
  Bottom 0.406: X3.2 60,12.52 60.07,12.45
P2
  Bottom 0.305: X3.8 52.45,18.8 54.36,20.7 57.53,20.7 58.17,21.34 58.17,23.24 60.1,25.17 60.1,26.25 60.27,26.42 61,26.42 X1.1
R2
  Bottom 0.305: R2.2 64.22,27.97 64.2,28 R3.1
  Bottom 0.406: U$2.-1 76.84,23.62
  Bottom 1.778: R2.2 68.07,27.97 68.1,28
  Bottom 2.184: U$2.- 76.84,23.62 76.58,23.88 76.58,26.76 75.35,28 68.1,28
REG25  (via drill 0.5)
  Top 0.305: 55.5,20.7 50.56,20.7 50.52,20.66 50.52,20.18 50.55,20.15 | 55.5,20.7 v60.07,20.7 | R6.1 50.57,20.2 50.55,20.18 50.55,20.15 | 55.45,30.85 55.45,20.75 55.5,20.7 | 50.55,20.15 50.57,20.13
  Bottom 0.254: C9.1 66.42,12.45 65.79,11.81 R1.2
  Bottom 0.305: X1.7 61.04,20.7 | 61.04,20.7 61.04,19.1 61.98,18.16 61.98,13.72 63.25,12.45 65.47,12.45 R1.2 | v60.07,20.7 61.04,20.7

### Text on the board
Bottom: MLAB | 2013 | JACHO
tPlace: + | - | LION1CELL01B | POWER IN | MLAB | POWER | STABLE | FUEL GAUGE | OUT | SDA | OUT 3V3 | SCL | HDQ | PS | GND | GND | POWER IN | 1 - STAT1 | 2 - PG | 3 - CMODE | 4 - CE | 5 - CELLS | OUT | JACHO | 2013 | ON | DONE | 100 % --------------- > 0 % | CHARGE | 1 | 2 | 3 | 4 | 5